# Altium schematic sheet 00-Top-layer.SchDoc
size A4
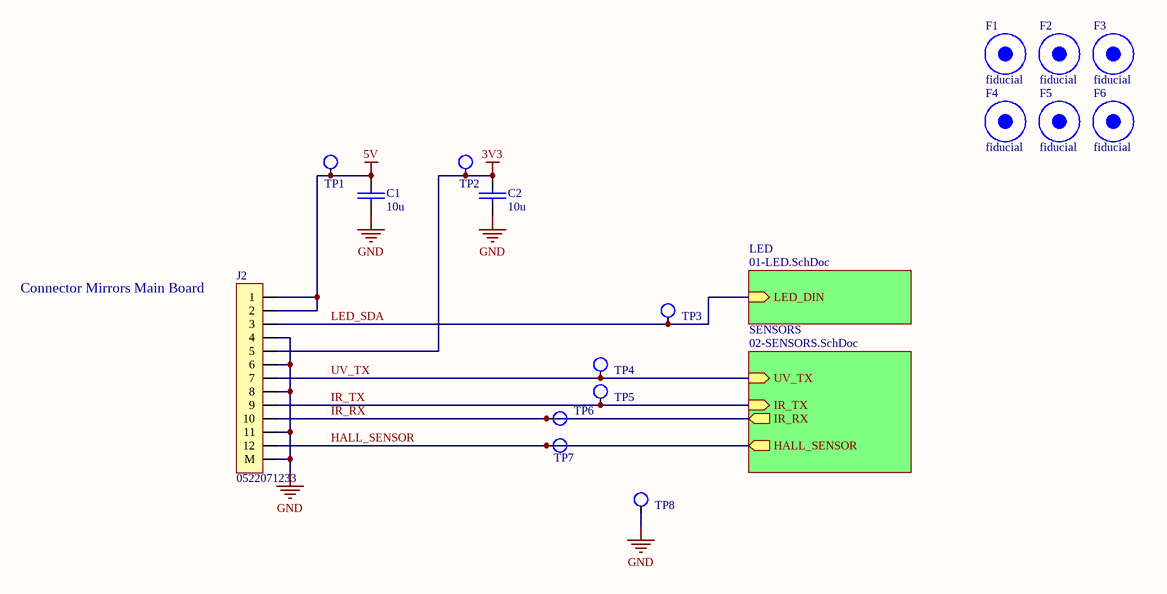
[diagram p0: 00-Top-layer.SchDoc]

## Parts
C1  10u  [CAPC100X50X65]
C2  10u  [CAPC100X50X65]
F1  fiducial  [fiducial_marker]  (no BOM)
F2  fiducial  [fiducial_marker]  (no BOM)
F3  fiducial  [fiducial_marker]  (no BOM)
F4  fiducial  [fiducial_marker]  (no BOM)
F5  fiducial  [fiducial_marker]  (no BOM)
F6  fiducial  [fiducial_marker]  (no BOM)
J2  0522071233  [CONN_0522711279]
TP1  Test Point  [tp_1mm]  (value not drawn)  (no BOM)
TP2  Test Point  [tp_1mm]  (value not drawn)  (no BOM)
TP3  Test Point  [tp_1mm]  (value not drawn)  (no BOM)
TP4  Test Point  [tp_1mm]  (value not drawn)  (no BOM)
TP5  Test Point  [tp_1mm]  (value not drawn)  (no BOM)
TP6  Test Point  [tp_1mm]  (value not drawn)  (no BOM)
TP7  Test Point  [tp_1mm]  (value not drawn)  (no BOM)
TP8  Test Point  [tp_1mm]  (value not drawn)  (no BOM)

## Sub-sheets
LED = 01-LED.SchDoc: LED_DIN (in)
SENSORS = 02-SENSORS.SchDoc: IR_RX (out), UV_TX (in), HALL_SENSOR (out), IR_TX (in)

## Nets
3V3: C2.1 J2.5 TP2.1
5V: C1.1 J2.1 J2.2 TP1.1
GND: C1.2 C2.2 J2.4 J2.6 J2.8 J2.11 J2.M TP8.1
HALL_SENSOR: J2.12 TP7.1 ; sheet SENSORS/HALL_SENSOR
IR_RX: J2.10 TP6.1 ; sheet SENSORS/IR_RX
IR_TX: J2.9 TP5.1 ; sheet SENSORS/IR_TX
LED_SDA: J2.3 TP3.1 ; sheet LED/LED_DIN
UV_TX: J2.7 TP4.1 ; sheet SENSORS/UV_TX

## Notes on the sheet
- (near J2) Connector Mirrors Main Board

## Library data of the parts
C1 C2 = C_10UF_10V_X5R_0402: CAP CER 10UF 10V X5R 0402; Manufacturer: Samsung Electro-Mechanics; Manufacturer PN: CL05A106MP5NUNC; Supplier PN: 1276-1450-1-ND
F1-F6 = fiducial_marker
J2 = CONN_FPC_Bottom 12POS_1MM_0522711279: CONN FPC BOTTOM 12POS 1.00MM R/A; Manufacturer: Molex; Manufacturer PN: 0522711279; Supplier: Digi-Key; Supplier PN: WM7960CT-ND; Package / Case: *
TP1-TP8 = TP_1mm